# Altium schematic sheet Buck Converter.SchDoc
size B; SheetNumber: 3; SheetTotal: 7
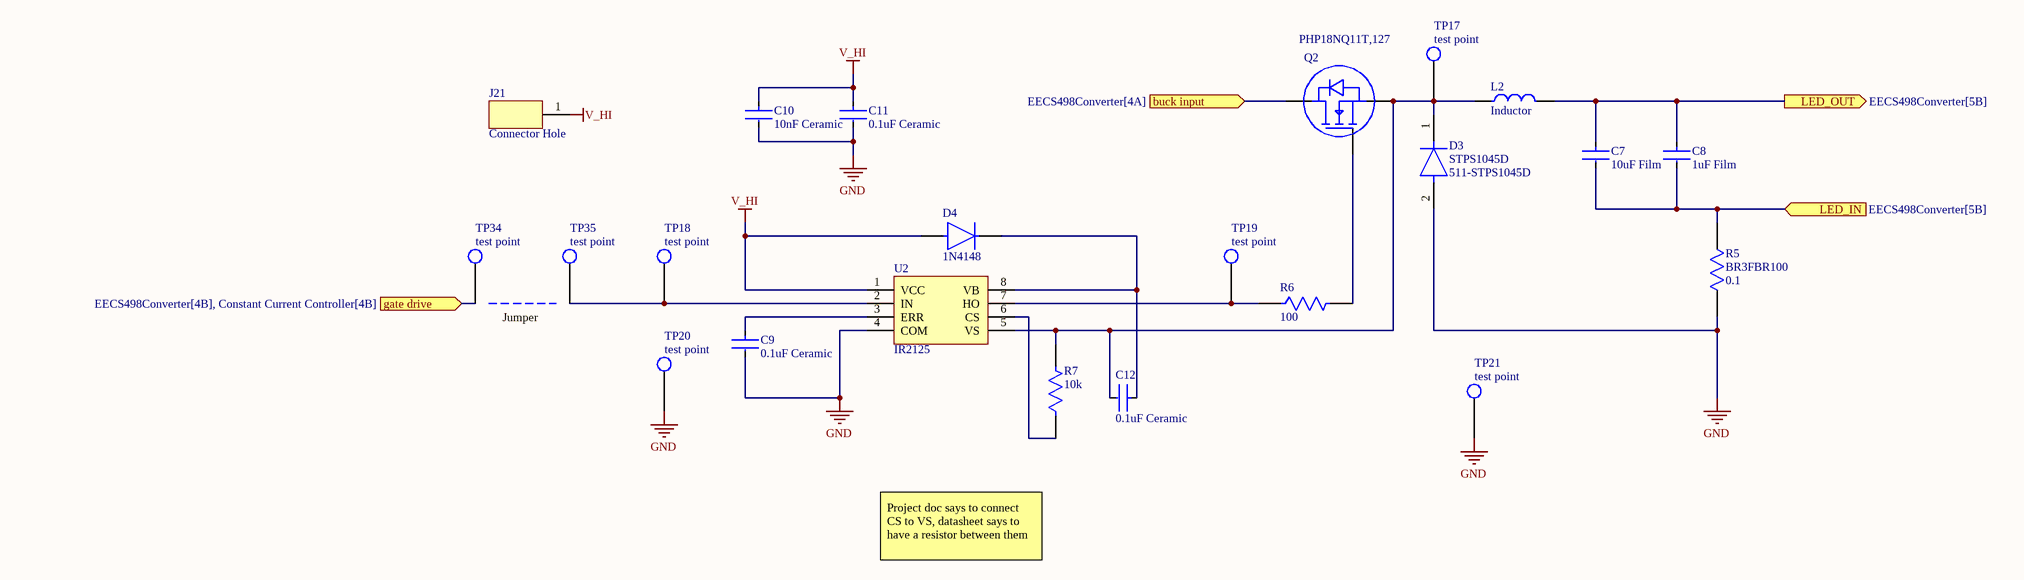
[diagram p0: Buck Converter.SchDoc]

## Parts
C7  10uF Film  [FP-FILM-CAP-22.5mm]
C8  1uF Film  [FP-FILM-CAP-10mm]
C9  0.1uF Ceramic  [FP-K15H5-MFG]
C10  10nF Ceramic  [FP-K15H5-MFG]
C11  0.1uF Ceramic  [FP-K15H5-MFG]
C12  0.1uF Ceramic  [FP-K15H5-MFG]
D3  STPS1045D  Supplier Part Number 1: 511-STPS1045D  [STPS1045D]
D4  1N4148  [FP-1N4148-MFG]
J21  Connector Hole  [Connector Hole]
L2  Inductor  [Power Inductor]
Q2  PHP18NQ11T,127  [1727-PHP18NQ11T,127-ND]
R5  BR3FBR100  value 0.1  [BR3FBR100]
R6  100  [FP-RLR07-MFG]
R7  10k  [FP-RLR07-MFG]
TP17  test point  [test point]
TP18  test point  [test point]
TP19  test point  [test point]
TP20  test point  [test point]
TP21  test point  [test point]
TP34  test point  [test point]
TP35  test point  [test point]
U2  IR2125  [DIP8]

## Ports
buck input (in, see EECS498Converter[4A]), gate drive (in, see EECS498Converter[4B], Constant Current Controller[4B]), LED_IN (in, see EECS498Converter[5B]), LED_OUT (out, see EECS498Converter[5B])

## Nets
GND: C9.2 C10.2 C11.2 D3.2(A) R5.1 TP20.1 TP21.1 U2.4(COM)
V_HI: C10.1 C11.1 D4.2(A) J21.1 U2.1(VCC)
buck input: Q2.2(D) ; port buck input
gate drive: TP34.1 ; port gate drive
LED_IN: C7.2 C8.2 R5.2 ; port LED_IN
LED_OUT: C7.1 C8.1 L2.2 ; port LED_OUT
NetC9_1: C9.1 U2.3(ERR)
NetC12_1: C12.1 D4.1(C) U2.8(VB)
NetC12_2: C12.2 D3.1(K) L2.1 Q2.3(S) R7.2 TP17.1 U2.5(VS)
NetQ2_1: Q2.1(G) R6.2
NetR6_1: R6.1 TP19.1 U2.7(HO)
NetR7_1: R7.1 U2.6(CS)
NetTP18_1: TP18.1 TP35.1 U2.2(IN)

## Notes on the sheet
- Jumper
- Project doc says to connect CS to VS, datasheet says to have a resistor between them

## Library data of the parts
C7 = 10uF Capacitor: CAP CER 10UF 50V X7R FILM; Capacitance: 100nF; Tolerance: 10%; Dielectric Material: Ceramic; Lead Length: 30mm; Lead Diameter: 0.5mm; Lead/Base Style: Formed Leads; Diameter: 500um; Max Operating Temperature: 125°C; Case/Package: Dipped; Dielectric: X7R; Lead Free: Lead Free; Construction: RADIAL; Voltage: 50V; Thickness: 2.6mm; Min Operating Temperature: -55°C; Lead Pitch: 5mm; Height: 4mm; Radiation Hardening: No; Voltage Rating: 50V; Depth: 2.5mm; Voltage Rating (DC): 50V; Package Quantity: 1; Weight: 0.005644oz; Series: K; Mount: Through Hole; Termination: Radial; Height - Seated (Max): 0.257inch; Length: 4mm; Packaging: Tape and Reel; Width: 2.5mm; RoHS Compliant: Yes
C8 = 1uf Capacitor: CAP CER 1UF 50V X7R FILM; Capacitance: 100nF; Tolerance: 10%; Dielectric Material: Ceramic; Lead Length: 30mm; Lead Diameter: 0.5mm; Lead/Base Style: Formed Leads; Diameter: 500um; Max Operating Temperature: 125°C; Case/Package: Dipped; Dielectric: X7R; Lead Free: Lead Free; Construction: RADIAL; Voltage: 50V; Thickness: 2.6mm; Min Operating Temperature: -55°C; Lead Pitch: 5mm; Height: 4mm; Radiation Hardening: No; Voltage Rating: 50V; Depth: 2.5mm; Voltage Rating (DC): 50V; Package Quantity: 1; Weight: 0.005644oz; Series: K; Mount: Through Hole; Termination: Radial; Height - Seated (Max): 0.257inch; Length: 4mm; Packaging: Tape and Reel; Width: 2.5mm; RoHS Compliant: Yes
C9 C11 C12 = 0.1uF Capacitor: CAP CER 0.1UF 50V X7R RADIAL; Capacitance: 100nF; Tolerance: 10%; Lead Length: 30mm; Lead Diameter: 0.5mm; Lead/Base Style: Formed Leads; Diameter: 500um; Max Operating Temperature: 125°C; Dielectric Material: Ceramic; Case/Package: Dipped; Dielectric: X7R; Lead Free: Lead Free; Construction: RADIAL; Voltage: 50V; Thickness: 2.6mm; Min Operating Temperature: -55°C; Lead Pitch: 5mm; Height: 4mm; Radiation Hardening: No; Voltage Rating: 50V; Depth: 2.5mm; Voltage Rating (DC): 50V; Package Quantity: 1; Weight: 0.005644oz; Series: K; Mount: Through Hole; Termination: Radial; Height - Seated (Max): 0.257inch; Length: 4mm; Packaging: Tape and Reel; Width: 2.5mm; RoHS Compliant: Yes
C10 = 10nF Capacitor: CAP CER 10nF 50V X7R RADIAL; Capacitance: 100nF; Tolerance: 10%; Lead Length: 30mm; Lead Diameter: 0.5mm; Lead/Base Style: Formed Leads; Diameter: 500um; Max Operating Temperature: 125°C; Dielectric Material: Ceramic; Case/Package: Dipped; Dielectric: X7R; Lead Free: Lead Free; Construction: RADIAL; Voltage: 50V; Thickness: 2.6mm; Min Operating Temperature: -55°C; Lead Pitch: 5mm; Height: 4mm; Radiation Hardening: No; Voltage Rating: 50V; Depth: 2.5mm; Voltage Rating (DC): 50V; Package Quantity: 1; Weight: 0.005644oz; Series: K; Mount: Through Hole; Termination: Radial; Height - Seated (Max): 0.257inch; Length: 4mm; Packaging: Tape and Reel; Width: 2.5mm; RoHS Compliant: Yes
D3 = STPS1045D: Diode 45 V 10A Through Hole TO-220AC; Supplier 1: Mouser
D4 = 1N4148: DIODE GEN PURP 100V 200MA DO35; Forward Voltage: 1V; Max Power Dissipation: 500mW; Max Reverse Current: 5uA; Forward Current: 300mA; Current: 4A; Reverse Recovery Time: 4ns; Element Configuration: Single; Outside Diameter: 1.85mm; Capacitance: 4pF; Polarity: Standard; Max Forward Surge Current (Ifsm): 1A; Reverse Voltage: 100V; Output Current: 200mA; Average Rectified Current: 200mA; Diameter: 1.91mm; Max Repetitive Reverse Voltage (Vrrm): 100V; Current Rating: 200mA; Case/Package: DO-35; Lead Free: Lead Free; Number of Pins: 2; Recovery Time: 4ns; Packaging: Bulk; Contact Plating: Tin; Voltage: 100V; Mount: Through Hole; Max Surge Current: 4A; Package Quantity: 2000; Width: 1.91mm; Max Reverse Voltage (DC): 100V; Length: 4.56mm; Radiation Hardening: No; Power Dissipation: 500mW; Voltage Rating (DC): 100V; Peak Non-Repetitive Surge Current: 4A; REACH SVHC: No SVHC; Height: 4.56mm; Max Operating Temperature: 175°C; Series: -; Weight: 0.01lb; Min Operating Temperature: -65°C
L2 = Inductor: DC Current: 180mA; Tolerance: 10%; Core Material: Ferrite; Q Factor: 27; Self Resonant Frequency: 25MHz; Shielding: Unshielded; Test Frequency: 1MHz; Inductance: 10uH; Series Resistance: 1.6R; Radiation Hardening: No; REACH SVHC: No SVHC; Width: 0.098inch; RoHS Compliant: Yes; Case/Package: 1210; Package Quantity: 2000; Height - Seated (Max): 0.083inch; Rated Current-Max: 180mA; Series: SIMID; Mount: Surface Mount; Depth: 2.8mm; Resistor Type: Wirewound; Max DC Current: 180mA; Termination: SMD/SMT; Contact Plating: Tin; Height: 2.1mm; Case Code (Metric): 3225; Lead Free: Lead Free; Weight: 0.001764oz; Max Operating Temperature: 125°C; Length: 3.5mm; Packaging: Tape and Reel; Case Code (Imperial): 1210; Inductance Tolerance: 10%; Ratings: AEC-Q200; Number of Pins: 2; Current Rating: 180mA; Military Standard: Not; DC Resistance (DCR): 1.6R
Q2 = PHP18NQ11T,127: N-Channel 110 V 18A (Tc) 79W (Tc) Through Hole TO-220AB; Supplier 1: Digi-Key; Supplier Part Number 1: 1727-PHP18NQ11T,127-ND
R5 = BR3FBR100: 100 mOhms ±1% 3W Through Hole Resistor Radial Current Sense, Flame Proof, Non-Inductive, Pulse Withstanding, Safety Metal Foil; Supplier 1: Future Electronics; Supplier Part Number 1: 7170987
R6 R7 = Resistor: Resistor, ± 1%, 250 mW, Axial Leaded, Metal Film, Military Reliability; NexarPartId: 39453770; Max Power Dissipation: 250mW; Resistance: 100kΩ; Lead Length: 38.1mm; Voltage Rating: 250V; Lead Diameter: 640µm; Temperature Coefficient: 100ppm/°C; Wire/Cable Diameter: 50.8µm; Military Standard: MIL-PRF-39017; REACH SVHC: Unknown; Min Operating Temperature: -65°C; Length: 7.62mm; Case/Package: Axial; Lead Free: Contains Lead; Height: 2.5mm; Contact Plating: Lead, Tin; Radiation Hardening: No; Composition: Metal Film; Voltage Rating (DC): 250V; Schedule B: 8533210090, 8533210090|8533210090, 8533210090|8533210090|8533210090, 8533210090|8533210090|8533210090|8533210090; Diameter: 2.29mm; Tolerance: 1%; Max Operating Temperature: 150°C; Number of Terminations: 2; RoHS: Non-Compliant; Features: Military, Moisture Resistant, Weldable; Power Rating: 250mW; Packaging: Bulk; Width: 2.29mm; Termination: Axial; Failure Rate: 0.001%
U2 = IR2125: High-Side Gate Driver IC Non-Inverting 8-PDIP; Supplier 1: Allied Electronics; Supplier Part Number 1: 70017143